# Altium schematic sheet TPS buckboost.SchDoc
size A4
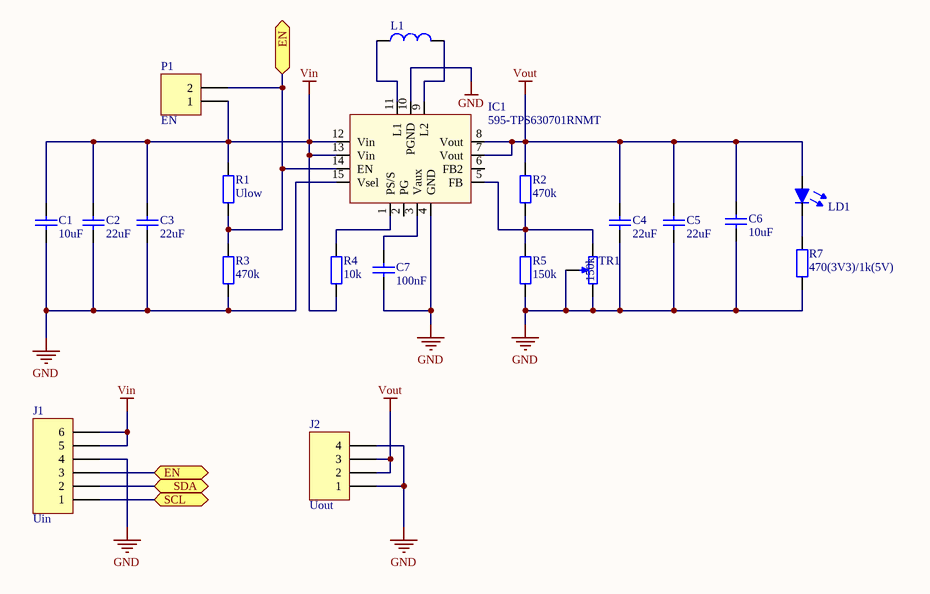
[diagram p0: TPS buckboost.SchDoc]

## Parts
C1  value 10uF  [0805 CAP]  (hidden comment: Capacitor)
C2  value 22uF  [1210 CAP]  (hidden comment: Capacitor)
C3  value 22uF  [1210 CAP]  (hidden comment: Capacitor)
C4  value 22uF  [1210 CAP]  (hidden comment: Capacitor)
C5  value 22uF  [1210 CAP]  (hidden comment: Capacitor)
C6  value 10uF  [0805 CAP]  (hidden comment: Capacitor)
C7  value 100nF  [0603 cap]  (hidden comment: Capacitor)
IC1  Supplier Part Number 1: 595-TPS630701RNMT  [VQFN TPS]  (hidden comment: TPS63070/71)
J1  Uin  [HDR1X6]
J2  Uout  [HDR1X4]
L1  Inductor  [FDSD0420-H]  (value not drawn)
LD1  LED diode  [LED_0603]  (value not drawn)
P1  EN  [HDR1X2]
R1  value Ulow  [0603 RES]  (hidden comment: Resistor generic)
R2  value 470k  [0603 RES]  (hidden comment: Resistor generic)
R3  value 470k  [0603 RES]  (hidden comment: Resistor generic)
R4  value 10k  [0603 RES]  (hidden comment: Resistor generic)
R5  value 150k  [0603 RES]  (hidden comment: Resistor generic)
R7  value 470(3V3)/1k(5V)  [0603 RES]  (hidden comment: Resistor generic)
TR1  value 150k  [Multiturn 1]  (hidden comment: NP)

## Ports
EN, SCL, SDA

## Nets
GND: C1.2 C2.1 C3.1 C4.1 C5.1 C6.2 C7.1 IC1.4(GND) IC1.10(PGND) IC1.15(Vsel) J1.4 J2.1 J2.4 R3.1 R5.1 R7.1 TR1.2(BOT) TR1.3(TAP)
Vin: C1.1 C2.2 C3.2 IC1.12(Vin) IC1.13(Vin) J1.5 J1.6 P1.1 R1.2 R4.1
Vout: C4.2 C5.2 C6.1 IC1.7(Vout) IC1.8(Vout) J2.2 J2.3 LD1.1(A1) R2.2
EN: IC1.14(EN) J1.3 P1.2 R1.1 R3.2 ; port EN
SCL: J1.1 ; port SCL
SDA: J1.2 ; port SDA
NetC7_2: C7.2 IC1.3(Vaux)
NetIC1_1: IC1.1(PS/S) R4.2
NetIC1_5: IC1.5(FB) R2.1 R5.2 TR1.1(TOP)
NetIC1_9: IC1.9(L2) L1.2
NetIC1_11: IC1.11(L1) L1.1
NetLD1_2: LD1.2(K) R7.2

Not connected (* = marked no-connect by the designer): IC1 2(PG) 6(FB2)

## Library data of the parts
C1-C5 C7 = Capacitor NP: Voltage: 10V
C6 = Capacitor NP: Voltage: *
IC1 = TPS63070/71: Buck-boost switcher; Vin: 2-16 VDC; Vout (TPS63070): 2,5-9 VDC; Vout (TPS63071): 5 VDC; Frequency: 2,4 MHz; Iout max: 2 A; Value: TPS63070/71; Supplier 1: Mouser
J1 = Header 6: Header, 6-Pin; LatestRevisionDate: 17-Jul-2002; LatestRevisionNote: Re-released for DXP Platform.; Publisher: Altium Limited
J2 = Header 4: Header, 4-Pin; LatestRevisionDate: 17-Jul-2002; LatestRevisionNote: Re-released for DXP Platform.; Publisher: Altium Limited
L1 = Inductor: Single coil; Value: FDSD0420-H-1R0M=P3; Current: *; Supplier 1: Farnell; Supplier Part Number 1: 2530091
LD1 = LED diode: LED; Value: Blue
P1 = Header 2: Header, 2-Pin
R1 = Resistor: NP
R2-R5 R7 = Resistor: Resistor SMD
TR1 = Resistor_trim: Trimmer